# EasyEDA Pro project CH32V307_V3.0.0.eprj, schematic CH32V307
Create Date: 2023-03-15; Page Name: CH32V307; Project Name: CH32V307_V3.0.0; Schematic Name: CH32V307; Update Date: 2023-03-28; Company: 嘉立创EDA; Page Size: A4; Version: V1.0
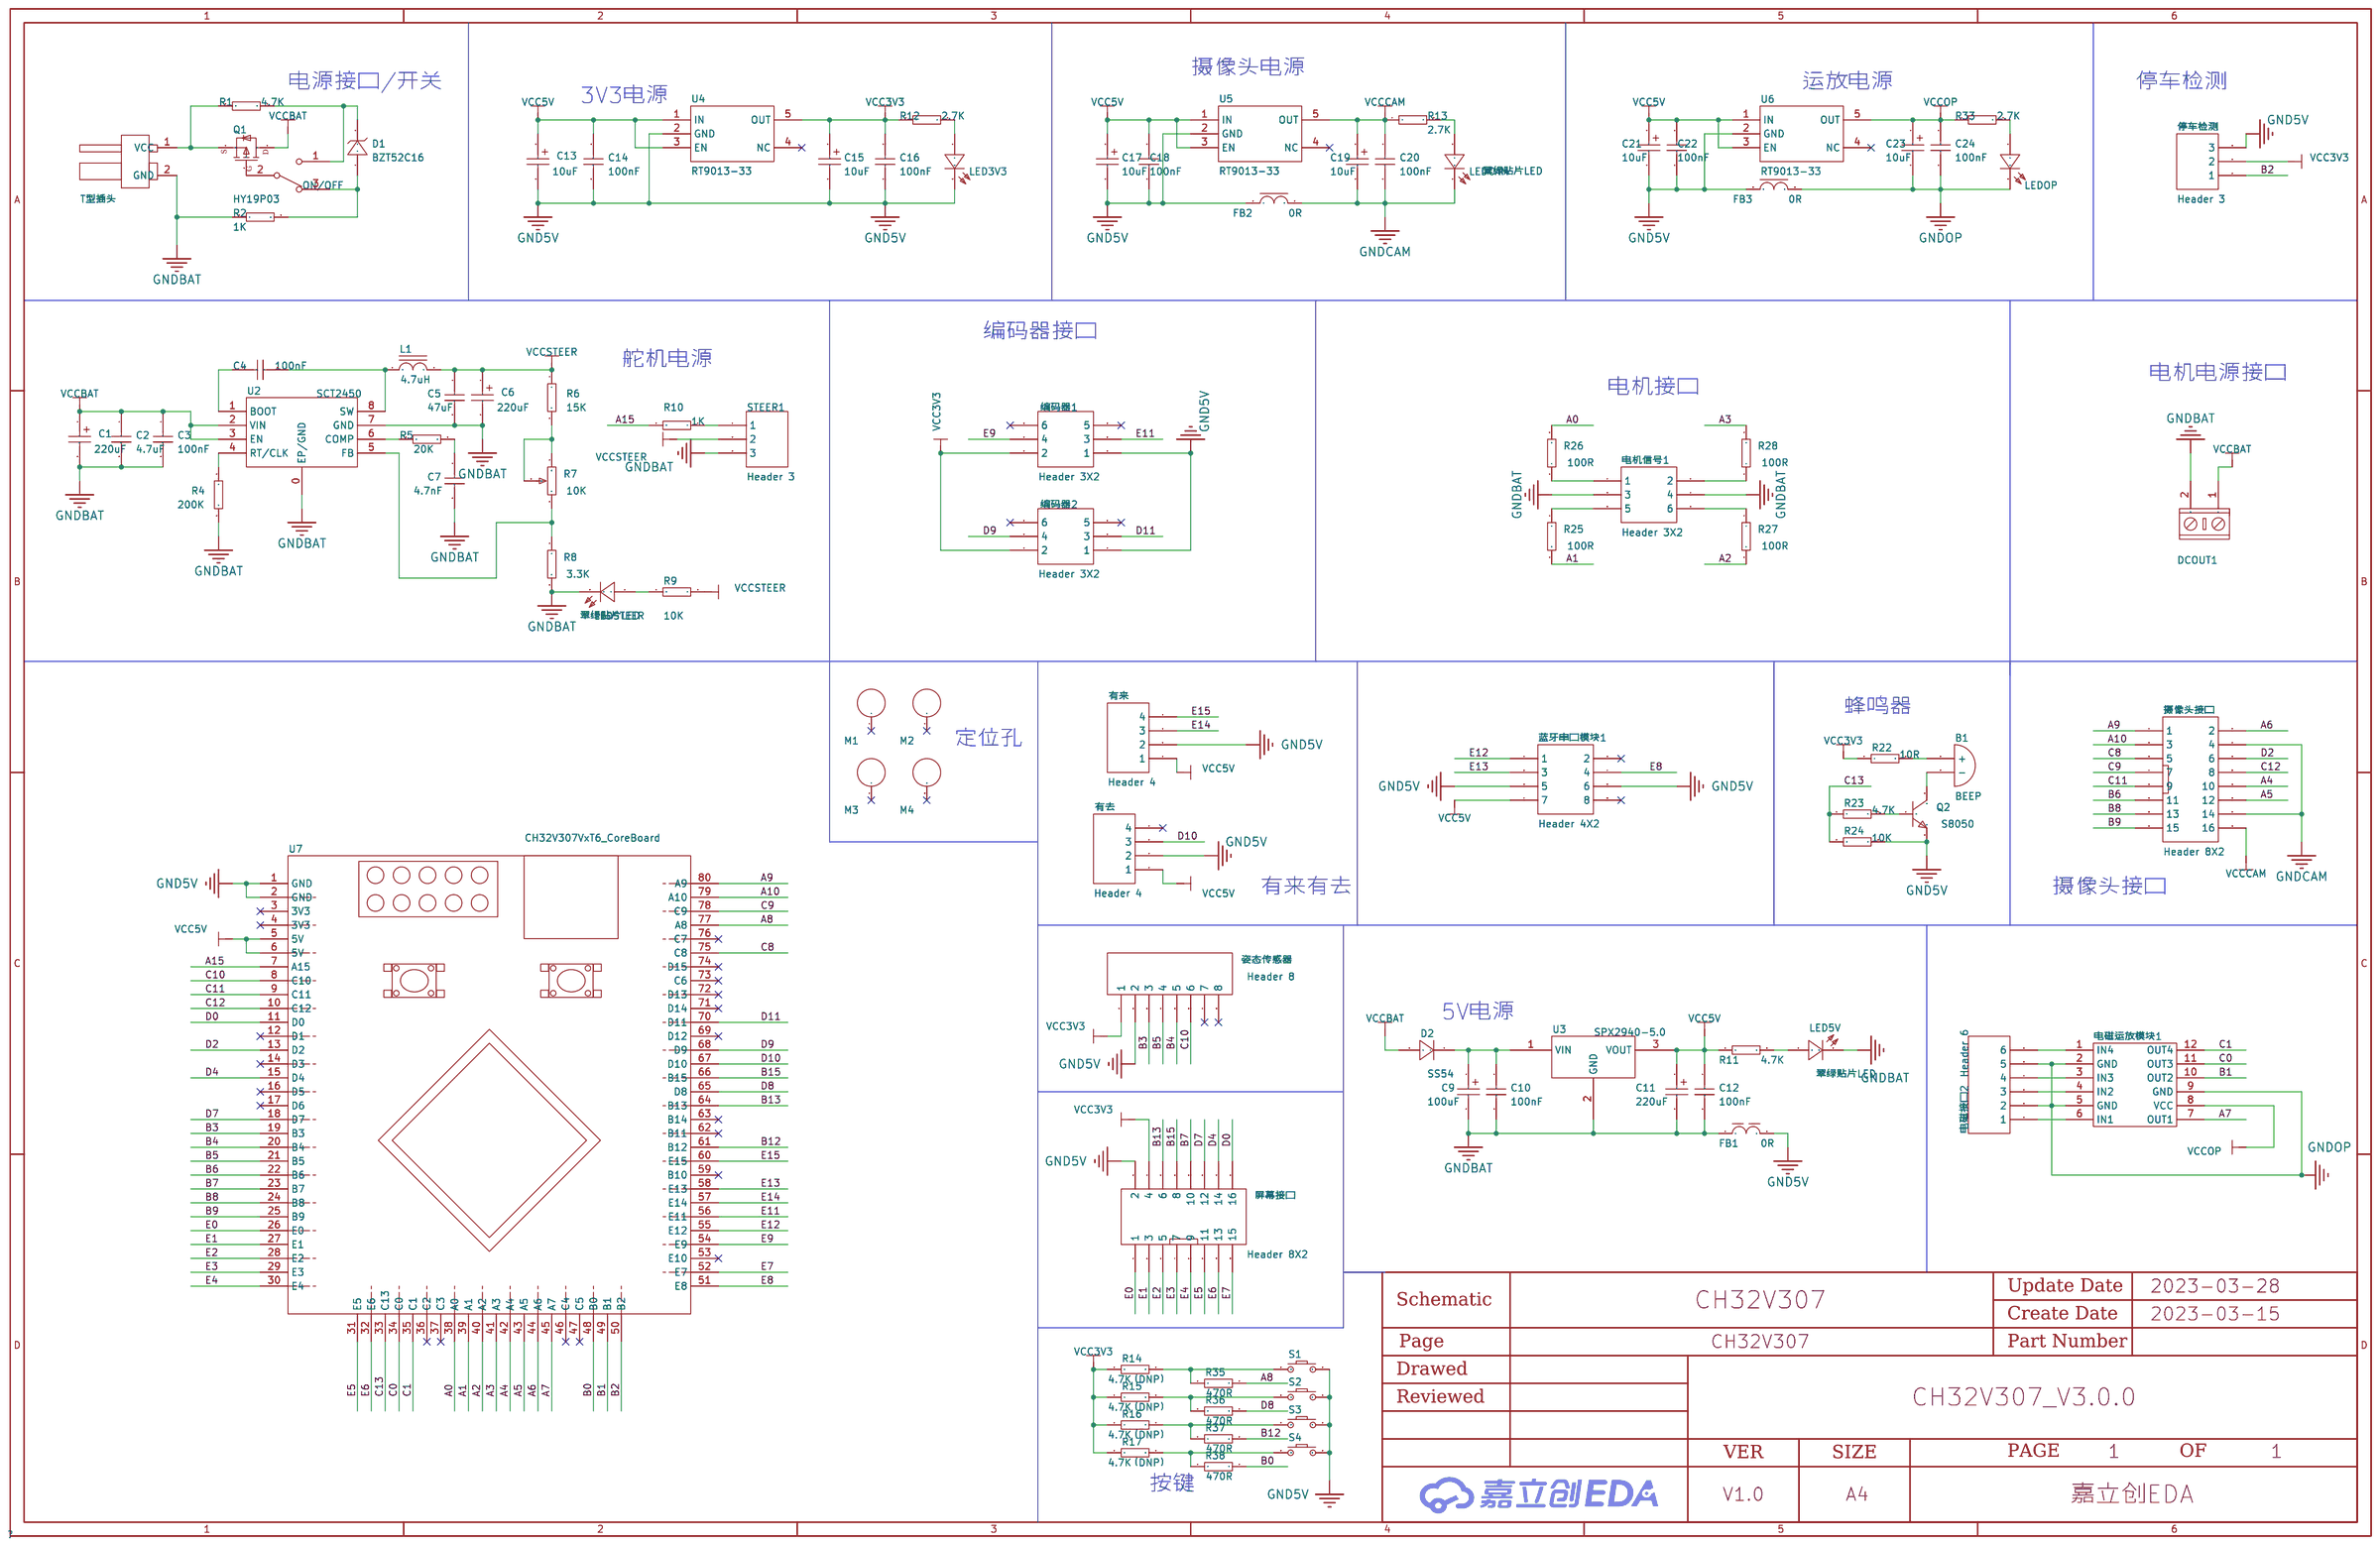
[diagram p0: schematic sheet]

## Parts
B1  BEEP  [BEEP 9x5.5mm]
C1  220uF  [CAPS6.3]
C2  4.7nF  [CAPC1608[0603]S-N]
C3  100nF  [CAPC1608[0603]S-N]
C4  100nF  [CAPC1608[0603]S-N]
C5  47uF  [CAPC3216[1206]S]
C6  220uF  [CAPS6.3]
C7  4.7nF  [CAPC1608[0603]S-N]
C9  100uF  [CAPS6.3]
C10  100nF  [CAPC1608[0603]S-N]
C11  220uF  [CAPS6.3]
C12  100nF  [CAPC1608[0603]S-N]
C13  10uF  [CAPT3216]
C14  100nF  [CAPC1608[0603]S-N]
C15  10uF  [CAPT3216]
C16  100nF  [CAPC1608[0603]S-N]
C17  10uF  [CAPT3216]
C18  100nF  [CAPC1608[0603]S-N]
C19  10uF  [CAPT3216]
C20  100nF  [CAPC1608[0603]S-N]
C21  10uF  [CAPT3216]
C22  100nF  [CAPC1608[0603]S-N]
C23  10uF  [CAPT3216]
C24  100nF  [CAPC1608[0603]S-N]
D1  BZT52C16  [SOD-123-L]
D2  SS54  [SMA[DO-214AC]]
DCOUT1  KF/WJ/DG 30x connecter  [KF/WJ/DG 301-2p-5.0mm]
FB1  0R  [INDC2012[0805]S]
FB2  0R  [INDC2012[0805]S]
FB3  0R  [INDC2012[0805]S]
L1  4.7uH  [0630 TPC 7*7*3]
LED3V3  翠绿贴片LED  [LEDC1608(0603)]
LED5V  翠绿贴片LED  [LEDC1608(0603)]
LEDCAM  翠绿贴片LED  [LEDC1608(0603)]
LEDOP  翠绿贴片LED  [LEDC1608(0603)]
LEDSTEER  翠绿贴片LED  [LEDC1608(0603)]
M1  MountHole  [M3-MountHole-Plated]
M2  MountHole  [M3-MountHole-Plated]
M3  MountHole  [M3-MountHole-Plated]
M4  MountHole  [M3-MountHole-Plated]
ON/OFF  SW-SPDT  [SS12D10]
Q1  HY19P03  [TO-252AA]
Q2  S8050  [SOT-23]
R1  4.7K  [RESC1608[0603]S-N]
R2  1K  [RESC1608[0603]S-N]
R4  200K  [RESC1608[0603]S-N]
R5  20K  [RESC1608[0603]S-N]
R6  15K  [RESC1608[0603]S-N]
R7  10K  [RESPOT3296]
R8  3.3K  [RESC1608[0603]S-N]
R9  10K  [RESC1608[0603]S-N]
R10  1K  [RESC1608[0603]S-N]
R11  4.7K  [RESC1608[0603]S-N]
R12  2.7K  [RESC1608[0603]S-N]
R13  2.7K  [RESC1608[0603]S-N]
R14  4.7K(DNP)  [RESC1608[0603]S-N]
R15  4.7K(DNP)  [RESC1608[0603]S-N]
R16  4.7K(DNP)  [RESC1608[0603]S-N]
R17  4.7K(DNP)  [RESC1608[0603]S-N]
R22  10R  [RESC1608[0603]S-N]
R23  4.7K  [RESC1608[0603]S-N]
R24  10K  [RESC1608[0603]S-N]
R25  100R  [RESC1608[0603]S-N]
R26  100R  [RESC1608[0603]S-N]
R27  100R  [RESC1608[0603]S-N]
R28  100R  [RESC1608[0603]S-N]
R33  2.7K  [RESC1608[0603]S-N]
R35  470R  [RESC1608[0603]S-N]
R36  470R  [RESC1608[0603]S-N]
R37  470R  [RESC1608[0603]S-N]
R38  470R  [RESC1608[0603]S-N]
S1  Button  [PTS810-3*4-CurvePin]
S2  Button  [PTS810-3*4-CurvePin]
S3  Button  [PTS810-3*4-CurvePin]
S4  Button  [PTS810-3*4-CurvePin]
STEER1  Header 3  [HDR1X3]
U1  T型插头  [Wired T-Header ThroughHole]
U2  SCT2450  [SOP-8E]
U3  SPX2940-5.0  [TO-263-3]
U4  RT9013-33  [SOT-23-5]
U5  RT9013-33  [SOT-23-5]
U6  RT9013-33  [SOT-23-5]
U7  CH32V307VxT6_CoreBoard  [CH32V307VxT6_CoreBoard]
停车检测  Header 3  [HDR1X3]
姿态传感器  Header 8  [HDR1X8]
屏幕接口  Header 8X2  [HDR2X8-M-SMT]
摄像头接口  Header 8X2  [HDR2X8-M-SMT]
有去  Header 4  [HDR1X4]
有来  Header 4  [HDR1X4]
电机信号1  Header 3X2  [HDR2X3-M-SMT]
电磁接口2  Header 6  [HDR1X6]
电磁运放模块1  OPA_MOD  [SEEKFREE_4CHANEL_OPAMOD]
编码器1  Header 3X2  [HDR2X3-M-SMT]
编码器2  Header 3X2  [HDR2X3-M-SMT]
蓝牙串口模块1  Header 4X2  [Female-Header-2.54-SMD-8]

## Library data of the parts
B1 = BEEP: Origin Footprint 2: BEEP 12x9.5mm
C1 C6 C11 = Cap-Solid_1: Published: 8-Jun-2000; Revision: July-2002: Re-released for DXP Platform.; Publisher: Altium Limited; Price(RMB): 0.000; Voltage: 25V; Origin Footprint 2: CAPS4; Origin Footprint 3: CAPS5; Origin Footprint 4: CAPS8; Origin Footprint 5: CAPS10
C2 C7 = Cap-Chip_3: Published: 2021-12-13; Revision: V1.2; Tolerance: ±10%; Type: X7R; Voltage: 50V; Origin Footprint 2: CAPC1310[0504]S; Origin Footprint 3: CAPC3216[1206]S; Origin Footprint 4: CAPC3225[1210]S; Origin Footprint 5: CAPC4532[1812]S; Origin Footprint 6: CAPC4564[1825]S; Origin Footprint 7: CAPC2012[0805]; Origin Footprint 8: CAPC3216[1206]; Origin Footprint 9: CAPC3225[1210]; Origin Footprint 10: CAPC4532[1812]; Origin Footprint 11: CAPC4564[1825]; Origin Footprint 12: CAPC1608[0603]-N; Origin Footprint 13: CAPC1608[0603]-L; Origin Footprint 14: CAPC1608[0603]-M; Origin Footprint 15: CAPC1608[0603]S-L; Origin Footprint 16: CAPC1608[0603]S-M; Origin Footprint 17: CAPC1005[0402]-L; Origin Footprint 18: CAPC1005[0402]-M; Origin Footprint 19: CAPC1005[0402]-N; Origin Footprint 20: CAPC1005[0402]S-L; Origin Footprint 21: CAPC1005[0402]S-M; Origin Footprint 22: CAPC1005[0402]S-N; Origin Footprint 23: CAPC2012[0805]S-L; Origin Footprint 24: CAPC2012[0805]S-M; Origin Footprint 25: CAPC2012[0805]S-N; Origin Footprint 26: CAPC0603[0201]-L; Origin Footprint 27: CAPC0603[0201]-N; Origin Footprint 28: CAPC0603[0201]-M; Origin Footprint 29: CAPC0603[0201]S-L; Origin Footprint 30: CAPC0603[0201]S-M; Origin Footprint 31: CAPC0603[0201]S-N
C3 C4 C10 C12 C14 C16 C18 C20 C22 C24 = Cap-Chip: Published: 2021-12-13; Revision: V1.2; Voltage: 50V; Tolerance: ±10%; Type: X7R; Origin Footprint 2: CAPC1310[0504]S; Origin Footprint 3: CAPC3216[1206]S; Origin Footprint 4: CAPC3225[1210]S; Origin Footprint 5: CAPC4532[1812]S; Origin Footprint 6: CAPC4564[1825]S; Origin Footprint 7: CAPC2012[0805]; Origin Footprint 8: CAPC3216[1206]; Origin Footprint 9: CAPC3225[1210]; Origin Footprint 10: CAPC4532[1812]; Origin Footprint 11: CAPC4564[1825]; Origin Footprint 12: CAPC1608[0603]-N; Origin Footprint 13: CAPC1608[0603]-L; Origin Footprint 14: CAPC1608[0603]-M; Origin Footprint 15: CAPC1608[0603]S-L; Origin Footprint 16: CAPC1608[0603]S-M; Origin Footprint 17: CAPC1005[0402]-L; Origin Footprint 18: CAPC1005[0402]-M; Origin Footprint 19: CAPC1005[0402]-N; Origin Footprint 20: CAPC1005[0402]S-L; Origin Footprint 21: CAPC1005[0402]S-M; Origin Footprint 22: CAPC1005[0402]S-N; Origin Footprint 23: CAPC2012[0805]S-L; Origin Footprint 24: CAPC2012[0805]S-M; Origin Footprint 25: CAPC2012[0805]S-N; Origin Footprint 26: CAPC0603[0201]-L; Origin Footprint 27: CAPC0603[0201]-N; Origin Footprint 28: CAPC0603[0201]-M; Origin Footprint 29: CAPC0603[0201]S-L; Origin Footprint 30: CAPC0603[0201]S-M; Origin Footprint 31: CAPC0603[0201]S-N
C5 = Cap-Chip_2: Published: 2021-12-13; Revision: V1.2; Tolerance: ±10%; Type: X5R; Voltage: 16V; Origin Footprint 2: CAPC1310[0504]S; Origin Footprint 3: CAPC3225[1210]S; Origin Footprint 4: CAPC4532[1812]S; Origin Footprint 5: CAPC4564[1825]S; Origin Footprint 6: CAPC2012[0805]; Origin Footprint 7: CAPC3216[1206]; Origin Footprint 8: CAPC3225[1210]; Origin Footprint 9: CAPC4532[1812]; Origin Footprint 10: CAPC4564[1825]; Origin Footprint 11: CAPC1608[0603]-N; Origin Footprint 12: CAPC1608[0603]-L; Origin Footprint 13: CAPC1608[0603]-M; Origin Footprint 14: CAPC1608[0603]S-L; Origin Footprint 15: CAPC1608[0603]S-M; Origin Footprint 16: CAPC1608[0603]S-N; Origin Footprint 17: CAPC1005[0402]-L; Origin Footprint 18: CAPC1005[0402]-M; Origin Footprint 19: CAPC1005[0402]-N; Origin Footprint 20: CAPC1005[0402]S-L; Origin Footprint 21: CAPC1005[0402]S-M; Origin Footprint 22: CAPC1005[0402]S-N; Origin Footprint 23: CAPC2012[0805]S-L; Origin Footprint 24: CAPC2012[0805]S-M; Origin Footprint 25: CAPC2012[0805]S-N; Origin Footprint 26: CAPC0603[0201]-L; Origin Footprint 27: CAPC0603[0201]-N; Origin Footprint 28: CAPC0603[0201]-M; Origin Footprint 29: CAPC0603[0201]S-L; Origin Footprint 30: CAPC0603[0201]S-M; Origin Footprint 31: CAPC0603[0201]S-N
C9 = Cap-Solid: Published: 8-Jun-2000; Revision: July-2002: Re-released for DXP Platform.; Publisher: Altium Limited; Price(RMB): 0.000; Voltage: 25V; Origin Footprint 2: CAPS4; Origin Footprint 3: CAPS5; Origin Footprint 4: CAPS8; Origin Footprint 5: CAPS10
C13 C15 C17 C19 C21 C23 = Cap-Tan: Published: 8-Jun-2000; Revision: July-2002: Re-released for DXP Platform.; Publisher: Altium Limited; Price(RMB): 0.000; Voltage: 16V; Origin Footprint 2: CAPT3528; Origin Footprint 3: CAPT6032; Origin Footprint 4: CAPT7343; Origin Footprint 5: CAPT7361
D1 = Diode TVS Uni-Dir: Published: 8-Jun-2000; Publisher: Altium Limited; Price(RMB): 0.000; Imax: 500mA; Origin Footprint 2: DO-41; Origin Footprint 3: SMA[DO-214AC]; Origin Footprint 4: SMB[DO-214AA]; Origin Footprint 5: SMC[DO-214AB]; Origin Footprint 6: SOD-123-FL; Origin Footprint 7: SOD-323; Origin Footprint 8: SOD-523-L; Origin Footprint 9: SOD-123-M; Origin Footprint 10: SOD-523-M
D2 = Diode: Published: 8-Jun-2000; Revision: July-2002: Re-released for DXP Platform.; Publisher: Altium Limited; Price(RMB): 0.000; Imax: 500mA; Origin Footprint 2: SMB[DO-214AA]; Origin Footprint 3: SMC[DO-214AB]; Origin Footprint 4: SOD-123-FL; Origin Footprint 5: SOD-123-M; Origin Footprint 6: SOD-323; Origin Footprint 7: SOD-523-L; Origin Footprint 8: SOD-523-M; Origin Footprint 9: SOD-123-L
DCOUT1 = KF/WJ/DG 30x
FB1 = Ind Chip 2: Published: 8-Jun-2000; Revision: July-2002: Re-released for DXP Platform.; Publisher: Altium Limited; Imax: 50mA; DCR: .1m; Price(RMB): 0.000
FB2 FB3 = Ind-Chip: Published: 2020-12-18; Revision: V1.0; Imax: 500mA; DCR: .1m; Origin Footprint 2: INDC1608[0603]S; Origin Footprint 3: INDC3216[1206]S; Origin Footprint 4: INDC4509[1806]S; Origin Footprint 5: INDC1005[0402]; Origin Footprint 6: INDC1608[0603]; Origin Footprint 7: INDC2012[0805]; Origin Footprint 8: INDC3216[1206]; Origin Footprint 9: INDC3225[1210]; Origin Footprint 10: INDC3216[1206]
L1 = Ind-Power: Published: 8-Jun-2000; Revision: July-2002: Re-released for DXP Platform.; Publisher: Altium Limited; DCR: .5m; Price(RMB): 0.000; Imax: 5A; Origin Footprint 2: CD31; Origin Footprint 3: CD32; Origin Footprint 4: CD42; Origin Footprint 5: CD43; Origin Footprint 6: CD52; Origin Footprint 7: CD53; Origin Footprint 8: CD54; Origin Footprint 9: CD73; Origin Footprint 10: CD75; Origin Footprint 11: CD104; Origin Footprint 12: CD105; Origin Footprint 13: CD106; Origin Footprint 14: 127 Shielded 12.5*12.5*7; Origin Footprint 15: 1050 TPC 10*10*5; Origin Footprint 16: 1265 TPC 12*12*6.5; Origin Footprint 17: CD104R; Origin Footprint 18: SLO2520; Origin Footprint 19: 1365 TPC 13*13*6.5; Origin Footprint 20: INDUCTOR; Origin Footprint 21: 0402 TPC 4*4*2
LED3V3 LED5V LEDCAM LEDOP LEDSTEER = LED Chip Green: Published: 8-Jun-2000; Revision: July-2002: Re-released for DXP Platform.; Publisher: Altium Limited; Price(RMB): 0.00; Origin Footprint 2: LEDC2012(0805); Origin Footprint 3: LEDC3216(1206); Origin Footprint 4: LEDC1608(0603)-L; Origin Footprint 5: LEDC2012(0805)-L; Origin Footprint 6: LEDC3216(1204); Origin Footprint 7: LEDC3528-2
M1-M4 = MountHole: Origin Footprint 2: M3-MountHole; Origin Footprint 3: M3-MountSlot; Origin Footprint 4: M3-MountSlot-Plated; Origin Footprint 5: M3-MountHole-4mm; Origin Footprint 6: M3-MountHole-5mm; Origin Footprint 7: M3-MountHole-6mm; Origin Footprint 8: M3-MountHole-7mm; Origin Footprint 9: M3-MountHole-8mm; Origin Footprint 10: M3-MountHole-9mm; Origin Footprint 11: M3-MountHole-10mm; Origin Footprint 12: M3-MountHole-11mm; Origin Footprint 13: M3-MountHole-12mm; Origin Footprint 14: M3-MountHole-13mm; Origin Footprint 15: M3-MountHole-14mm; Origin Footprint 16: M3-MountHole-15mm; Origin Footprint 17: M3-MountHole-16mm; Origin Footprint 18: M3-MountHole-17mm; Origin Footprint 19: M3-MountHole-18mm; Origin Footprint 20: M3-MountHole-19mm; Origin Footprint 21: M3-MountHole-20mm; Origin Footprint 22: M3-MountHole-Plated-4MM; Origin Footprint 23: M3-MountHole-Plated-5MM; Origin Footprint 24: M3-MountHole-Plated-6MM; Origin Footprint 25: M3-MountHole-Plated-7MM; Origin Footprint 26: M3-MountHole-Plated-8MM; Origin Footprint 27: M3-MountHole-Plated-9MM; Origin Footprint 28: M3-MountHole-Plated-10MM; Origin Footprint 29: M3-MountHole-Plated-11MM; Origin Footprint 30: M3-MountHole-Plated-12MM; Origin Footprint 31: M3-MountHole-Plated-13MM; Origin Footprint 32: M3-MountHole-Plated-14MM; Origin Footprint 33: M3-MountHole-Plated-15MM; Origin Footprint 34: M3-MountHole-Plated-16MM; Origin Footprint 35: M3-MountHole-Plated-17MM; Origin Footprint 36: M3-MountHole-Plated-18MM; Origin Footprint 37: M3-MountHole-Plated-19MM; Origin Footprint 38: M3-MountHole-Plated-20MM
ON/OFF = SW-SPDT: Published: 24-Mar-1999; Publisher: Altium Limited; Price(RMB): 0.000; Origin Footprint 2: ToggleSwitch 7102; Origin Footprint 3: SS12D06; Origin Footprint 4: SS12D07VG4; Origin Footprint 5: MSK-12C02
Q1 = HY19P03
Q2 = NPN S8050: Published: 8-Jun-2000; Revision: July-2002: Re-released for DXP Platform.; Publisher: Altium Limited; Price(RMB): 0.000
R1 R11 R23 = Res-Chip_2: Published: 8-Jun-2000; Revision: July-2002: Re-released for DXP Platform.; Tolerance: ±1%; Origin Footprint 2: RESC3225[1210]S; Origin Footprint 3: RESC5025[2010]S; Origin Footprint 4: RESC6332[2512]S; Origin Footprint 5: RESC5025[2010]; Origin Footprint 6: RESC6332[2512]; Origin Footprint 7: RESC3225[1210]; Origin Footprint 8: RESC3216[1206]; Origin Footprint 9: RESC2012[0805]; Origin Footprint 10: RESC1608[0603]-M; Origin Footprint 11: RESC1608[0603]-L; Origin Footprint 12: RESC1608[0603]-N; Origin Footprint 13: RESC1608[0603]S-L; Origin Footprint 14: RESC1608[0603]S-M; Origin Footprint 15: RESC1005[0402]-L; Origin Footprint 16: RESC1005[0402]-N; Origin Footprint 17: RESC1005[0402]-M; Origin Footprint 18: RESC1005[0402]S-L; Origin Footprint 19: RESC1005[0402]S-M; Origin Footprint 20: RESC1005[0402]S-N; Origin Footprint 21: RESC2012[0805]S-L; Origin Footprint 22: RESC2012[0805]S-M; Origin Footprint 23: RESC2012[0805]S-N; Origin Footprint 24: RESC3216[1206]S-L; Origin Footprint 25: RESC3216[1206]S-M; Origin Footprint 26: RESC3216[1206]S-N; Origin Footprint 27: RESC0603[0201]-L; Origin Footprint 28: RESC0603[0201]-M; Origin Footprint 29: RESC0603[0201]-N; Origin Footprint 30: RESC0603[0201]S-L; Origin Footprint 31: RESC0603[0201]S-M; Origin Footprint 32: RESC0603[0201]S-N
R2 R10 = Res-Chip_1: Published: 8-Jun-2000; Revision: July-2002: Re-released for DXP Platform.; Tolerance: ±1%; Origin Footprint 2: RESC3225[1210]S; Origin Footprint 3: RESC5025[2010]S; Origin Footprint 4: RESC6332[2512]S; Origin Footprint 5: RESC5025[2010]; Origin Footprint 6: RESC6332[2512]; Origin Footprint 7: RESC3225[1210]; Origin Footprint 8: RESC3216[1206]; Origin Footprint 9: RESC2012[0805]; Origin Footprint 10: RESC1608[0603]-M; Origin Footprint 11: RESC1608[0603]-L; Origin Footprint 12: RESC1608[0603]-N; Origin Footprint 13: RESC1608[0603]S-L; Origin Footprint 14: RESC1608[0603]S-M; Origin Footprint 15: RESC1005[0402]-L; Origin Footprint 16: RESC1005[0402]-N; Origin Footprint 17: RESC1005[0402]-M; Origin Footprint 18: RESC1005[0402]S-L; Origin Footprint 19: RESC1005[0402]S-M; Origin Footprint 20: RESC1005[0402]S-N; Origin Footprint 21: RESC2012[0805]S-L; Origin Footprint 22: RESC2012[0805]S-M; Origin Footprint 23: RESC2012[0805]S-N; Origin Footprint 24: RESC3216[1206]S-L; Origin Footprint 25: RESC3216[1206]S-M; Origin Footprint 26: RESC3216[1206]S-N; Origin Footprint 27: RESC0603[0201]-L; Origin Footprint 28: RESC0603[0201]-M; Origin Footprint 29: RESC0603[0201]-N; Origin Footprint 30: RESC0603[0201]S-L; Origin Footprint 31: RESC0603[0201]S-M; Origin Footprint 32: RESC0603[0201]S-N
R4 = Res-Chip_4: Published: 8-Jun-2000; Revision: July-2002: Re-released for DXP Platform.; Tolerance: ±1%; Origin Footprint 2: RESC3225[1210]S; Origin Footprint 3: RESC5025[2010]S; Origin Footprint 4: RESC6332[2512]S; Origin Footprint 5: RESC5025[2010]; Origin Footprint 6: RESC6332[2512]; Origin Footprint 7: RESC3225[1210]; Origin Footprint 8: RESC3216[1206]; Origin Footprint 9: RESC2012[0805]; Origin Footprint 10: RESC1608[0603]-M; Origin Footprint 11: RESC1608[0603]-L; Origin Footprint 12: RESC1608[0603]-N; Origin Footprint 13: RESC1608[0603]S-L; Origin Footprint 14: RESC1608[0603]S-M; Origin Footprint 15: RESC1005[0402]-L; Origin Footprint 16: RESC1005[0402]-N; Origin Footprint 17: RESC1005[0402]-M; Origin Footprint 18: RESC1005[0402]S-L; Origin Footprint 19: RESC1005[0402]S-M; Origin Footprint 20: RESC1005[0402]S-N; Origin Footprint 21: RESC2012[0805]S-L; Origin Footprint 22: RESC2012[0805]S-M; Origin Footprint 23: RESC2012[0805]S-N; Origin Footprint 24: RESC3216[1206]S-L; Origin Footprint 25: RESC3216[1206]S-M; Origin Footprint 26: RESC3216[1206]S-N; Origin Footprint 27: RESC0603[0201]-L; Origin Footprint 28: RESC0603[0201]-M; Origin Footprint 29: RESC0603[0201]-N; Origin Footprint 30: RESC0603[0201]S-L; Origin Footprint 31: RESC0603[0201]S-M; Origin Footprint 32: RESC0603[0201]S-N
R5 = Res-Chip_5: Published: 8-Jun-2000; Revision: July-2002: Re-released for DXP Platform.; Tolerance: ±1%; Origin Footprint 2: RESC3225[1210]S; Origin Footprint 3: RESC5025[2010]S; Origin Footprint 4: RESC6332[2512]S; Origin Footprint 5: RESC5025[2010]; Origin Footprint 6: RESC6332[2512]; Origin Footprint 7: RESC3225[1210]; Origin Footprint 8: RESC3216[1206]; Origin Footprint 9: RESC2012[0805]; Origin Footprint 10: RESC1608[0603]-M; Origin Footprint 11: RESC1608[0603]-L; Origin Footprint 12: RESC1608[0603]-N; Origin Footprint 13: RESC1608[0603]S-L; Origin Footprint 14: RESC1608[0603]S-M; Origin Footprint 15: RESC1005[0402]-L; Origin Footprint 16: RESC1005[0402]-N; Origin Footprint 17: RESC1005[0402]-M; Origin Footprint 18: RESC1005[0402]S-L; Origin Footprint 19: RESC1005[0402]S-M; Origin Footprint 20: RESC1005[0402]S-N; Origin Footprint 21: RESC2012[0805]S-L; Origin Footprint 22: RESC2012[0805]S-M; Origin Footprint 23: RESC2012[0805]S-N; Origin Footprint 24: RESC3216[1206]S-L; Origin Footprint 25: RESC3216[1206]S-M; Origin Footprint 26: RESC3216[1206]S-N; Origin Footprint 27: RESC0603[0201]-L; Origin Footprint 28: RESC0603[0201]-M; Origin Footprint 29: RESC0603[0201]-N; Origin Footprint 30: RESC0603[0201]S-L; Origin Footprint 31: RESC0603[0201]S-M; Origin Footprint 32: RESC0603[0201]S-N
R6 = Res-Chip_6: Published: 8-Jun-2000; Revision: July-2002: Re-released for DXP Platform.; Tolerance: ±1%; Origin Footprint 2: RESC3225[1210]S; Origin Footprint 3: RESC5025[2010]S; Origin Footprint 4: RESC6332[2512]S; Origin Footprint 5: RESC5025[2010]; Origin Footprint 6: RESC6332[2512]; Origin Footprint 7: RESC3225[1210]; Origin Footprint 8: RESC3216[1206]; Origin Footprint 9: RESC2012[0805]; Origin Footprint 10: RESC1608[0603]-M; Origin Footprint 11: RESC1608[0603]-L; Origin Footprint 12: RESC1608[0603]-N; Origin Footprint 13: RESC1608[0603]S-L; Origin Footprint 14: RESC1608[0603]S-M; Origin Footprint 15: RESC1005[0402]-L; Origin Footprint 16: RESC1005[0402]-N; Origin Footprint 17: RESC1005[0402]-M; Origin Footprint 18: RESC1005[0402]S-L; Origin Footprint 19: RESC1005[0402]S-M; Origin Footprint 20: RESC1005[0402]S-N; Origin Footprint 21: RESC2012[0805]S-L; Origin Footprint 22: RESC2012[0805]S-M; Origin Footprint 23: RESC2012[0805]S-N; Origin Footprint 24: RESC3216[1206]S-L; Origin Footprint 25: RESC3216[1206]S-M; Origin Footprint 26: RESC3216[1206]S-N; Origin Footprint 27: RESC0603[0201]-L; Origin Footprint 28: RESC0603[0201]-M; Origin Footprint 29: RESC0603[0201]-N; Origin Footprint 30: RESC0603[0201]S-L; Origin Footprint 31: RESC0603[0201]S-M; Origin Footprint 32: RESC0603[0201]S-N
R7 = Res-Adj-3p: Origin Footprint 2: RESPOTSMALL; Origin Footprint 3: EVM3-3x3ADJ; Origin Footprint 4: RESPOT3386P
R8 = Res-Chip_7: Published: 8-Jun-2000; Revision: July-2002: Re-released for DXP Platform.; Tolerance: ±1%; Origin Footprint 2: RESC3225[1210]S; Origin Footprint 3: RESC5025[2010]S; Origin Footprint 4: RESC6332[2512]S; Origin Footprint 5: RESC5025[2010]; Origin Footprint 6: RESC6332[2512]; Origin Footprint 7: RESC3225[1210]; Origin Footprint 8: RESC3216[1206]; Origin Footprint 9: RESC2012[0805]; Origin Footprint 10: RESC1608[0603]-M; Origin Footprint 11: RESC1608[0603]-L; Origin Footprint 12: RESC1608[0603]-N; Origin Footprint 13: RESC1608[0603]S-L; Origin Footprint 14: RESC1608[0603]S-M; Origin Footprint 15: RESC1005[0402]-L; Origin Footprint 16: RESC1005[0402]-N; Origin Footprint 17: RESC1005[0402]-M; Origin Footprint 18: RESC1005[0402]S-L; Origin Footprint 19: RESC1005[0402]S-M; Origin Footprint 20: RESC1005[0402]S-N; Origin Footprint 21: RESC2012[0805]S-L; Origin Footprint 22: RESC2012[0805]S-M; Origin Footprint 23: RESC2012[0805]S-N; Origin Footprint 24: RESC3216[1206]S-L; Origin Footprint 25: RESC3216[1206]S-M; Origin Footprint 26: RESC3216[1206]S-N; Origin Footprint 27: RESC0603[0201]-L; Origin Footprint 28: RESC0603[0201]-M; Origin Footprint 29: RESC0603[0201]-N; Origin Footprint 30: RESC0603[0201]S-L; Origin Footprint 31: RESC0603[0201]S-M; Origin Footprint 32: RESC0603[0201]S-N
R9 R24 = Res-Chip: Published: 8-Jun-2000; Revision: July-2002: Re-released for DXP Platform.; Tolerance: ±1%; Origin Footprint 2: RESC3225[1210]S; Origin Footprint 3: RESC5025[2010]S; Origin Footprint 4: RESC6332[2512]S; Origin Footprint 5: RESC5025[2010]; Origin Footprint 6: RESC6332[2512]; Origin Footprint 7: RESC3225[1210]; Origin Footprint 8: RESC3216[1206]; Origin Footprint 9: RESC2012[0805]; Origin Footprint 10: RESC1608[0603]-M; Origin Footprint 11: RESC1608[0603]-L; Origin Footprint 12: RESC1608[0603]-N; Origin Footprint 13: RESC1608[0603]S-L; Origin Footprint 14: RESC1608[0603]S-M; Origin Footprint 15: RESC1005[0402]-L; Origin Footprint 16: RESC1005[0402]-N; Origin Footprint 17: RESC1005[0402]-M; Origin Footprint 18: RESC1005[0402]S-L; Origin Footprint 19: RESC1005[0402]S-M; Origin Footprint 20: RESC1005[0402]S-N; Origin Footprint 21: RESC2012[0805]S-L; Origin Footprint 22: RESC2012[0805]S-M; Origin Footprint 23: RESC2012[0805]S-N; Origin Footprint 24: RESC3216[1206]S-L; Origin Footprint 25: RESC3216[1206]S-M; Origin Footprint 26: RESC3216[1206]S-N; Origin Footprint 27: RESC0603[0201]-L; Origin Footprint 28: RESC0603[0201]-M; Origin Footprint 29: RESC0603[0201]-N; Origin Footprint 30: RESC0603[0201]S-L; Origin Footprint 31: RESC0603[0201]S-M; Origin Footprint 32: RESC0603[0201]S-N
R12 R13 R33 = Res-Chip_3: Published: 8-Jun-2000; Revision: July-2002: Re-released for DXP Platform.; Tolerance: ±1%; Origin Footprint 2: RESC3225[1210]S; Origin Footprint 3: RESC5025[2010]S; Origin Footprint 4: RESC6332[2512]S; Origin Footprint 5: RESC5025[2010]; Origin Footprint 6: RESC6332[2512]; Origin Footprint 7: RESC3225[1210]; Origin Footprint 8: RESC3216[1206]; Origin Footprint 9: RESC2012[0805]; Origin Footprint 10: RESC1608[0603]-M; Origin Footprint 11: RESC1608[0603]-L; Origin Footprint 12: RESC1608[0603]-N; Origin Footprint 13: RESC1608[0603]S-L; Origin Footprint 14: RESC1608[0603]S-M; Origin Footprint 15: RESC1005[0402]-L; Origin Footprint 16: RESC1005[0402]-N; Origin Footprint 17: RESC1005[0402]-M; Origin Footprint 18: RESC1005[0402]S-L; Origin Footprint 19: RESC1005[0402]S-M; Origin Footprint 20: RESC1005[0402]S-N; Origin Footprint 21: RESC2012[0805]S-L; Origin Footprint 22: RESC2012[0805]S-M; Origin Footprint 23: RESC2012[0805]S-N; Origin Footprint 24: RESC3216[1206]S-L; Origin Footprint 25: RESC3216[1206]S-M; Origin Footprint 26: RESC3216[1206]S-N; Origin Footprint 27: RESC0603[0201]-L; Origin Footprint 28: RESC0603[0201]-M; Origin Footprint 29: RESC0603[0201]-N; Origin Footprint 30: RESC0603[0201]S-L; Origin Footprint 31: RESC0603[0201]S-M; Origin Footprint 32: RESC0603[0201]S-N
R14-R17 = Res-Chip_9: Published: 8-Jun-2000; Revision: July-2002: Re-released for DXP Platform.; Tolerance: ±1%; Origin Footprint 2: RESC3225[1210]S; Origin Footprint 3: RESC5025[2010]S; Origin Footprint 4: RESC6332[2512]S; Origin Footprint 5: RESC5025[2010]; Origin Footprint 6: RESC6332[2512]; Origin Footprint 7: RESC3225[1210]; Origin Footprint 8: RESC3216[1206]; Origin Footprint 9: RESC2012[0805]; Origin Footprint 10: RESC1608[0603]-M; Origin Footprint 11: RESC1608[0603]-L; Origin Footprint 12: RESC1608[0603]-N; Origin Footprint 13: RESC1608[0603]S-L; Origin Footprint 14: RESC1608[0603]S-M; Origin Footprint 15: RESC1005[0402]-L; Origin Footprint 16: RESC1005[0402]-N; Origin Footprint 17: RESC1005[0402]-M; Origin Footprint 18: RESC1005[0402]S-L; Origin Footprint 19: RESC1005[0402]S-M; Origin Footprint 20: RESC1005[0402]S-N; Origin Footprint 21: RESC2012[0805]S-L; Origin Footprint 22: RESC2012[0805]S-M; Origin Footprint 23: RESC2012[0805]S-N; Origin Footprint 24: RESC3216[1206]S-L; Origin Footprint 25: RESC3216[1206]S-M; Origin Footprint 26: RESC3216[1206]S-N; Origin Footprint 27: RESC0603[0201]-L; Origin Footprint 28: RESC0603[0201]-M; Origin Footprint 29: RESC0603[0201]-N; Origin Footprint 30: RESC0603[0201]S-L; Origin Footprint 31: RESC0603[0201]S-M; Origin Footprint 32: RESC0603[0201]S-N
R22 = Res-Chip_10: Published: 8-Jun-2000; Revision: July-2002: Re-released for DXP Platform.; Tolerance: ±1%; Origin Footprint 2: RESC3225[1210]S; Origin Footprint 3: RESC5025[2010]S; Origin Footprint 4: RESC6332[2512]S; Origin Footprint 5: RESC5025[2010]; Origin Footprint 6: RESC6332[2512]; Origin Footprint 7: RESC3225[1210]; Origin Footprint 8: RESC3216[1206]; Origin Footprint 9: RESC2012[0805]; Origin Footprint 10: RESC1608[0603]-M; Origin Footprint 11: RESC1608[0603]-L; Origin Footprint 12: RESC1608[0603]-N; Origin Footprint 13: RESC1608[0603]S-L; Origin Footprint 14: RESC1608[0603]S-M; Origin Footprint 15: RESC1005[0402]-L; Origin Footprint 16: RESC1005[0402]-N; Origin Footprint 17: RESC1005[0402]-M; Origin Footprint 18: RESC1005[0402]S-L; Origin Footprint 19: RESC1005[0402]S-M; Origin Footprint 20: RESC1005[0402]S-N; Origin Footprint 21: RESC2012[0805]S-L; Origin Footprint 22: RESC2012[0805]S-M; Origin Footprint 23: RESC2012[0805]S-N; Origin Footprint 24: RESC3216[1206]S-L; Origin Footprint 25: RESC3216[1206]S-M; Origin Footprint 26: RESC3216[1206]S-N; Origin Footprint 27: RESC0603[0201]-L; Origin Footprint 28: RESC0603[0201]-M; Origin Footprint 29: RESC0603[0201]-N; Origin Footprint 30: RESC0603[0201]S-L; Origin Footprint 31: RESC0603[0201]S-M; Origin Footprint 32: RESC0603[0201]S-N
R25-R28 = Res-Chip_8: Published: 8-Jun-2000; Revision: July-2002: Re-released for DXP Platform.; Tolerance: ±1%; Origin Footprint 2: RESC3225[1210]S; Origin Footprint 3: RESC5025[2010]S; Origin Footprint 4: RESC6332[2512]S; Origin Footprint 5: RESC5025[2010]; Origin Footprint 6: RESC6332[2512]; Origin Footprint 7: RESC3225[1210]; Origin Footprint 8: RESC3216[1206]; Origin Footprint 9: RESC2012[0805]; Origin Footprint 10: RESC1608[0603]-M; Origin Footprint 11: RESC1608[0603]-L; Origin Footprint 12: RESC1608[0603]-N; Origin Footprint 13: RESC1608[0603]S-L; Origin Footprint 14: RESC1608[0603]S-M; Origin Footprint 15: RESC1005[0402]-L; Origin Footprint 16: RESC1005[0402]-N; Origin Footprint 17: RESC1005[0402]-M; Origin Footprint 18: RESC1005[0402]S-L; Origin Footprint 19: RESC1005[0402]S-M; Origin Footprint 20: RESC1005[0402]S-N; Origin Footprint 21: RESC2012[0805]S-L; Origin Footprint 22: RESC2012[0805]S-M; Origin Footprint 23: RESC2012[0805]S-N; Origin Footprint 24: RESC3216[1206]S-L; Origin Footprint 25: RESC3216[1206]S-M; Origin Footprint 26: RESC3216[1206]S-N; Origin Footprint 27: RESC0603[0201]-L; Origin Footprint 28: RESC0603[0201]-M; Origin Footprint 29: RESC0603[0201]-N; Origin Footprint 30: RESC0603[0201]S-L; Origin Footprint 31: RESC0603[0201]S-M; Origin Footprint 32: RESC0603[0201]S-N
R35-R38 = Res-Chip_11: Published: 8-Jun-2000; Revision: July-2002: Re-released for DXP Platform.; Tolerance: ±1%; Origin Footprint 2: RESC3225[1210]S; Origin Footprint 3: RESC5025[2010]S; Origin Footprint 4: RESC6332[2512]S; Origin Footprint 5: RESC5025[2010]; Origin Footprint 6: RESC6332[2512]; Origin Footprint 7: RESC3225[1210]; Origin Footprint 8: RESC3216[1206]; Origin Footprint 9: RESC2012[0805]; Origin Footprint 10: RESC1608[0603]-M; Origin Footprint 11: RESC1608[0603]-L; Origin Footprint 12: RESC1608[0603]-N; Origin Footprint 13: RESC1608[0603]S-L; Origin Footprint 14: RESC1608[0603]S-M; Origin Footprint 15: RESC1005[0402]-L; Origin Footprint 16: RESC1005[0402]-N; Origin Footprint 17: RESC1005[0402]-M; Origin Footprint 18: RESC1005[0402]S-L; Origin Footprint 19: RESC1005[0402]S-M; Origin Footprint 20: RESC1005[0402]S-N; Origin Footprint 21: RESC2012[0805]S-L; Origin Footprint 22: RESC2012[0805]S-M; Origin Footprint 23: RESC2012[0805]S-N; Origin Footprint 24: RESC3216[1206]S-L; Origin Footprint 25: RESC3216[1206]S-M; Origin Footprint 26: RESC3216[1206]S-N; Origin Footprint 27: RESC0603[0201]-L; Origin Footprint 28: RESC0603[0201]-M; Origin Footprint 29: RESC0603[0201]-N; Origin Footprint 30: RESC0603[0201]S-L; Origin Footprint 31: RESC0603[0201]S-M; Origin Footprint 32: RESC0603[0201]S-N
S1-S4 = KEY: Published: 24-Mar-1999; Publisher: Altium Limited; Price(RMB): 0.000; Origin Footprint 2: KEY-2-SMD-3*4; Origin Footprint 3: KEY-4-DIP-6*6; Origin Footprint 4: KEY-2-SMD-3*6-L; Origin Footprint 5: KEY-2-SMD-3*6-M; Origin Footprint 6: KEY-4-SMD-6*6; Origin Footprint 7: KEY-2-SMD-Side-3*6*3.5; Origin Footprint 8: KEY-4-SMD-12*12; Origin Footprint 9: TS-1809SM-A
STEER1 停车检测 = Header 3: LatestRevisionDate: 17-Jul-2002; LatestRevisionNote: Re-released for DXP Platform.; Publisher: Altium Limited; Price(RMB): 0.00; Origin Footprint 2: XH2.54-3; Origin Footprint 3: VH3.96-3; Origin Footprint 4: PH2.0-3; Origin Footprint 5: GH1.25T-3P; Origin Footprint 6: XH2.54-3-L; Origin Footprint 7: XH2.54-WS-3P; Origin Footprint 8: MX1.25T-3P-H; Origin Footprint 9: MX1.25T-3P-V
U1 = T_Header: Origin Footprint 2: T_DC; Origin Footprint 3: Wired T-Header
U2 = SCT2450
U3 = LM2940-5.0
U4-U6 = RT9013-33
U7 = CH32V307VxT6_CoreBoardV1.3
姿态传感器 = Header 8: LatestRevisionDate: 17-Jul-2002; LatestRevisionNote: Re-released for DXP Platform.; Publisher: Altium Limited; Price(RMB): 0.00; Origin Footprint 2: XH2.54V-8; Origin Footprint 3: XH2.54-8; Origin Footprint 4: VH3.96-8; Origin Footprint 5: PH2.0-8; Origin Footprint 6: GH1.25T-8P
屏幕接口 摄像头接口 = Header 8X2: LatestRevisionDate: 17-Jul-2002; LatestRevisionNote: Re-released for DXP Platform.; Publisher: Altium Limited; Price(RMB): 0.00; Origin Footprint 2: HDR2X8; Origin Footprint 3: IDC2.54-16; Origin Footprint 4: HDR2X8-F-SMT; Origin Footprint 5: HDR2X8-F-High
有去 有来 = Header 4: LatestRevisionDate: 17-Jul-2002; LatestRevisionNote: Re-released for DXP Platform.; Publisher: Altium Limited; Price(RMB): 0.00; Origin Footprint 2: XH2.54-4; Origin Footprint 3: VH3.96-4; Origin Footprint 4: PH2.0-4; Origin Footprint 5: HDR1X4_Download; Origin Footprint 6: HDR1X4-NS; Origin Footprint 7: GH1.25T-4P; Origin Footprint 8: XH2.54-4-L; Origin Footprint 9: HDR1X4-TP; Origin Footprint 10: HDR1X4-TP-NS
电机信号1 编码器1 编码器2 = Header 3X2: LatestRevisionDate: 17-Jul-2002; LatestRevisionNote: Re-released for DXP Platform.; Publisher: Altium Limited; Price(RMB): 0.00; Origin Footprint 2: HDR2X3; Origin Footprint 3: HDR2X3-F-SMT
电磁接口2 = Header 6: LatestRevisionDate: 17-Jul-2002; LatestRevisionNote: Re-released for DXP Platform.; Publisher: Altium Limited; Price(RMB): 0.00; Origin Footprint 2: PH2.0-6; Origin Footprint 3: XH2.54-6; Origin Footprint 4: VH3.96-6; Origin Footprint 5: GH1.25T-6P; Origin Footprint 6: ZH1.5-WF-6P
电磁运放模块1 = OPA_4CHANNEL_SEEKFREE
蓝牙串口模块1 = Header 4X2: LatestRevisionDate: 17-Jul-2002; LatestRevisionNote: Re-released for DXP Platform.; Publisher: Altium Limited; Price(RMB): 0.00; Origin Footprint 2: HDR2X4; Origin Footprint 3: HDR2X4-M-SMT; Origin Footprint 4: HDR2X4-F-SMT

## Nets
GND5V: C13.2 C14.2 C15.2 C16.2 C17.2 C18.2 C21.2 C22.2 FB1.2 FB2.1 FB3.1 LED3V3.C Q2.2(E) R24.2 S1.1 S2.1 S3.1 S4.1 U4.2(GND) U5.2(GND) U6.2(GND) U7.1(GND) U7.2(GND) 停车检测.3 姿态传感器.2 屏幕接口.2 有去.2 有来.2 编码器1.1 编码器2.1 蓝牙串口模块1.5 蓝牙串口模块1.6
GNDBAT: C1.2 C2.2 C3.2 C5.2 C6.2 C7.2 C9.2 C10.2 C11.2 C12.2 DCOUT1.2 FB1.1 LED5V.C LEDSTEER.C R2.1 R4.2 R8.2 STEER1.3 U1.2(GND) U2.0(EP/GND) U2.7(GND) U3.2(GND) 电机信号1.3 电机信号1.4
GNDCAM: C19.2 C20.2 FB2.2 LEDCAM.C 摄像头接口.4 摄像头接口.14
GNDOP: C23.2 C24.2 FB3.2 LEDOP.C 电磁接口2.2 电磁接口2.5 电磁运放模块1.2(GND) 电磁运放模块1.5(GND) 电磁运放模块1.9(GND)
VCC3V3: C15.1 C16.1 R12.1 R14.1 R15.1 R16.1 R17.1 R22.1 U4.5(OUT) 停车检测.2 姿态传感器.1 屏幕接口.4 编码器1.2 编码器2.2
VCC5V: C11.1 C12.1 C13.1 C14.1 C17.1 C18.1 C21.1 C22.1 R11.1 U3.3(VOUT) U4.1(IN) U4.3(EN) U5.1(IN) U5.3(EN) U6.1(IN) U6.3(EN) U7.5(5V) U7.6(5V) 有去.1 有来.1 蓝牙串口模块1.7
VCCBAT: C1.1 C2.1 C3.1 D2.A DCOUT1.1 Q1.1(D) U2.2(VIN) U2.3(EN)
VCCCAM: C19.1 C20.1 R13.1 U5.5(OUT) 摄像头接口.16
VCCOP: C23.1 C24.1 R33.1 U6.5(OUT) 电磁运放模块1.8(VCC)
VCCSTEER: C5.1 C6.1 L1.2 R6.1 R9.2 STEER1.2
A0: R26.2 U7.38(A0)
A1: R25.2 U7.39(A1)
A2: R27.2 U7.40(A2)
A3: R28.2 U7.41(A3)
A4: U7.42(A4) 摄像头接口.10
A5: U7.43(A5) 摄像头接口.12
A6: U7.44(A6) 摄像头接口.2
A7: U7.45(A7) 电磁运放模块1.7(OUT1)
A8: R35.2 U7.77(A8)
A9: U7.80(A9) 摄像头接口.1
A10: U7.79(A10) 摄像头接口.3
A15: R10.2 U7.7(A15)
B0: R38.2 U7.48(B0)
B1: U7.49(B1) 电磁运放模块1.10(OUT2)
B2: U7.50(B2) 停车检测.1
B3: U7.19(B3) 姿态传感器.3
B4: U7.20(B4) 姿态传感器.5
B5: U7.21(B5) 姿态传感器.4
B6: U7.22(B6) 摄像头接口.11
B7: U7.23(B7) 屏幕接口.10
B8: U7.24(B8) 摄像头接口.13
B9: U7.25(B9) 摄像头接口.15
B12: R37.2 U7.61(B12)
B13: U7.64(B13) 屏幕接口.6
B15: U7.66(B15) 屏幕接口.8
C0: U7.34(C0) 电磁运放模块1.11(OUT3)
C1: U7.35(C1) 电磁运放模块1.12(OUT4)
C8: U7.75(C8) 摄像头接口.5
C9: U7.78(C9) 摄像头接口.7
C10: U7.8(C10) 姿态传感器.6
C11: U7.9(C11) 摄像头接口.9
C12: U7.10(C12) 摄像头接口.8
C13: R23.1 R24.1 U7.33(C13)
D0: U7.11(D0) 屏幕接口.16
D2: U7.13(D2) 摄像头接口.6
D4: U7.15(D4) 屏幕接口.14
D7: U7.18(D7) 屏幕接口.12
D8: R36.2 U7.65(D8)
D9: U7.68(D9) 编码器2.4
D10: U7.67(D10) 有去.3
D11: U7.70(D11) 编码器2.3
E0: U7.26(E0) 屏幕接口.1
E1: U7.27(E1) 屏幕接口.3
E2: U7.28(E2) 屏幕接口.5
E3: U7.29(E3) 屏幕接口.7
E4: U7.30(E4) 屏幕接口.9
E5: U7.31(E5) 屏幕接口.11
E6: U7.32(E6) 屏幕接口.13
E7: U7.52(E7) 屏幕接口.15
E8: U7.51(E8) 蓝牙串口模块1.4
E9: U7.54(E9) 编码器1.4
E11: U7.56(E11) 编码器1.3
E12: U7.55(E12) 蓝牙串口模块1.1
E13: U7.58(E13) 蓝牙串口模块1.3
E14: U7.57(E14) 有来.3
E15: U7.60(E15) 有来.4
$1N1646: Q1.3(S) R1.1 U1.1(VCC)
$1N1675: D1.A ON/OFF.3 R2.2
$1N1680: D1.K ON/OFF.1 R1.2
$1N4031: LED3V3.A R12.2
$1N14893: LEDCAM.A R13.2
$1N15943: C9.1 C10.1 D2.K U3.1(VIN)
$1N17858: LED5V.A R11.2
$1N22991: LEDOP.A R33.2
$1N30175: ON/OFF.2 Q1.2(G)
$1N38666: R4.1 U2.4(RT/CLK)
$1N39173: C4.1 U2.1(BOOT)
$1N39467: C4.2 L1.1 U2.8(SW)
$1N41387: R6.2 R7.1(TOP) R7.ADJ
$1N41664: R5.1 U2.6(COMP)
$1N41948: C7.1 R5.2
$1N42725: R7.2(BOT) R8.1 U2.5(FB)
$1N43649: LEDSTEER.A R9.1
$1N45499: R10.1 STEER1.1
$1N56324: R14.2 R35.1 S1.2
$1N56387: R15.2 R36.1 S2.2
$1N56450: R16.2 R37.1 S3.2
$1N56513: R17.2 R38.1 S4.2
$1N101481: B1.1(+) R22.2
$1N101720: B1.2(-) Q2.3(C)
$1N102266: Q2.1(B) R23.2
$1N103802: R25.1 电机信号1.5
$1N103804: R26.1 电机信号1.1
$1N103886: R27.1 电机信号1.6
$1N103888: R28.1 电机信号1.2
$1N112323: 电磁接口2.6 电磁运放模块1.1(IN4)
$1N112483: 电磁接口2.4 电磁运放模块1.3(IN3)
$1N112563: 电磁接口2.3 电磁运放模块1.4(IN2)
$1N112723: 电磁接口2.1 电磁运放模块1.6(IN1)

Not connected (* = marked no-connect by the designer): M1 1*; M2 1*; M3 1*; M4 1*; U4 4(NC)*; U5 4(NC)*; U6 4(NC)*; U7 3(3V3)* 4(3V3)* 12(D1)* 14(D3)* 16(D5)* 17(D6)* 36(C2)* 37(C3)* 46(C4)* 47(C5)* 53(E10)* 59(B10)* 62(B11)* 63(B14)* 69(D12)* 71(D14)* 72(D13)* 73(C6)* 74(D15)* 76(C7)*; 姿态传感器 7* 8*; 有去 4*; 编码器1 5* 6*; 编码器2 5* 6*; 蓝牙串口模块1 2* 8*

## Notes on the sheet
- 摄像头电源
- 电源接口/开关
- 运放电源
- 停车检测
- 3V3电源
- 编码器接口
- 舵机电源
- 电机电源接口
- 电机接口
- 蜂鸣器
- 定位孔
- 有来有去
- 摄像头接口
- 5V电源
- 按键
